# Altium schematic sheet POWER_MEASUREMENT.SchDoc
size 420 x 297 mm; SheetNumber: 6; SheetTotal: 32
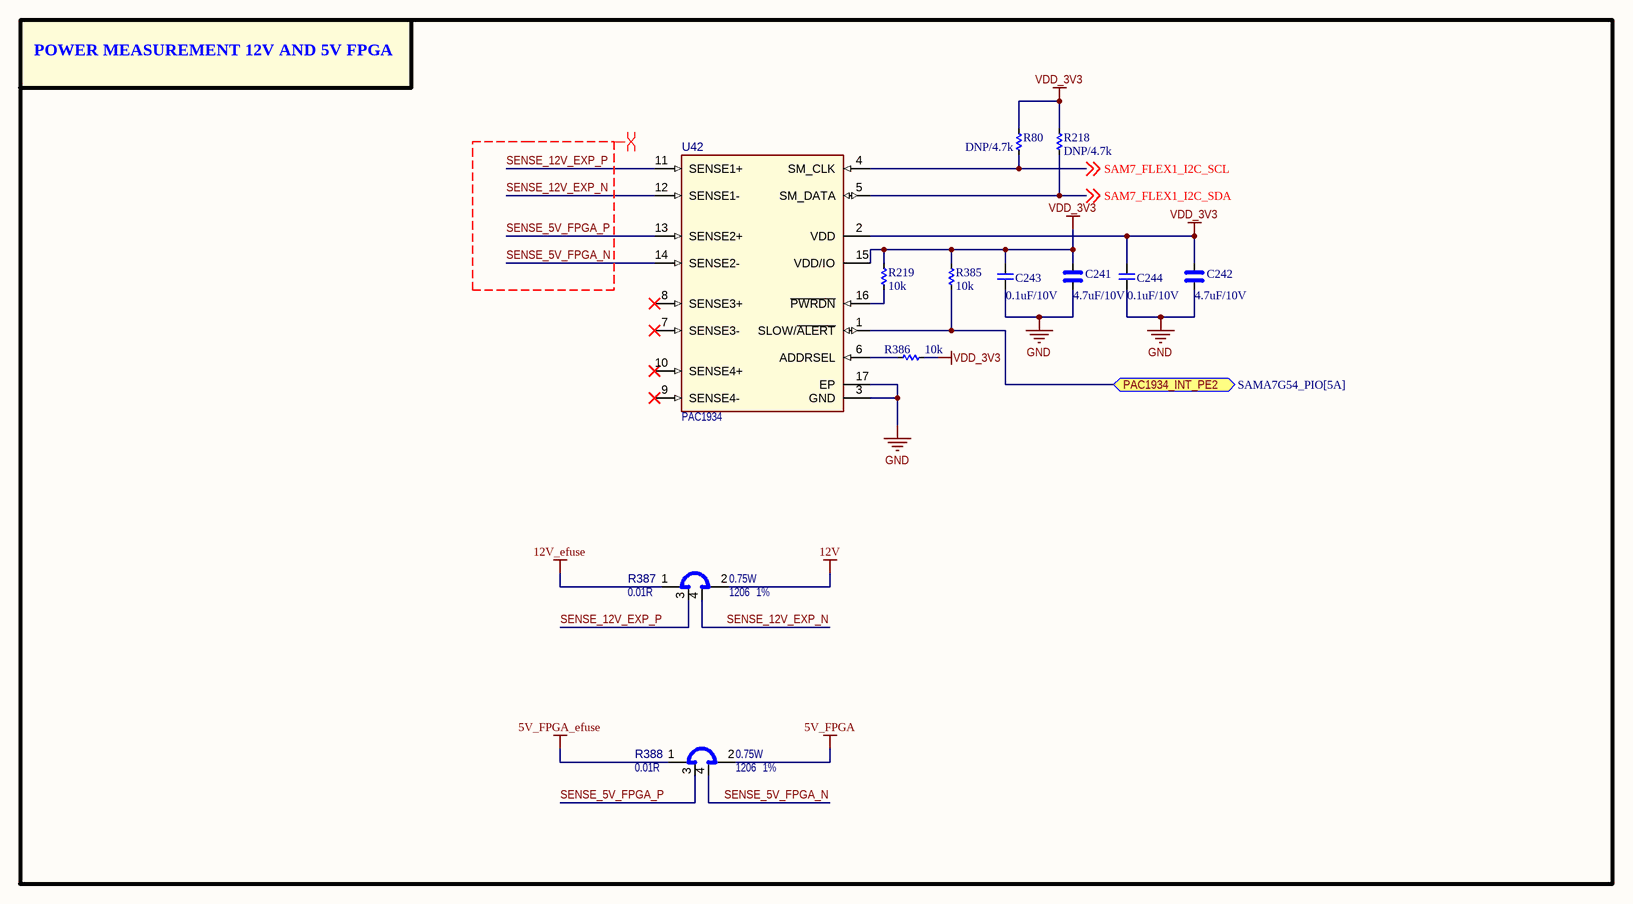
[diagram p0: POWER_MEASUREMENT.SchDoc]

## Parts
C241  4.7uF/10V  [CAP_C_1005X50_L]
C242  4.7uF/10V  [CAP_C_1005X50_L]
C243  0.1uF/10V  [CAP_C_1005X50_L]
C244  0.1uF/10V  [CAP_C_1005X50_L]
R80  DNP/4.7k  [RES_C_1005x30_L]
R218  DNP/4.7k  [RES_C_1005x30_L]
R219  10k  [RES_C_1005x30_L]
R385  10k  [RES_C_1005x30_L]
R386  10k  [RES_C_1005x30_L]
R387  value 0.01R  Package: 1206  Tolerance: 1%  Power: 0.75W  [RES_C_1206_SHUNT]  (hidden comment: KRL1632E-M-R010-F-T5)
R388  value 0.01R  Package: 1206  Tolerance: 1%  Power: 0.75W  [RES_C_1206_SHUNT]  (hidden comment: KRL1632E-M-R010-F-T5)
U42  value PAC1934  [UQFN-16_4X4_EP2.6X2.6]  (hidden comment: PAC1934 UQFN-16)

## Blocks framed on the sheet
POWER MEASUREMENT 12V AND 5V FPGA: C241-C244 R80 R218 R219 R385-R388 U42

## Ports
PAC1934_INT_PE2 (bidir, see SAMA7G54_PIO[5A])

## Nets
5V_FPGA: R388.2
5V_FPGA_efuse: R388.1
12V: R387.2
12V_efuse: R387.1
GND: C241.2 C242.2 C243.2 C244.2 U42.3(GND) U42.17(EP)
VDD_3V3: C241.1 C242.1 C243.1 C244.1 R80.1 R218.1 R219.1 R385.1 R386.2 U42.2(VDD) U42.15(VDD/IO)
PAC1934_INT_PE2: R385.2 U42.1(SLOW/~{ALERT}) ; port PAC1934_INT_PE2
SAM7_FLEX1_I2C_SCL: R80.2 U42.4(SM_CLK) ; off-sheet SAM7_FLEX1_I2C_SCL
SAM7_FLEX1_I2C_SDA: R218.2 U42.5(SM_DATA) ; off-sheet SAM7_FLEX1_I2C_SDA
SENSE_5V_FPGA_N: R388.4 U42.14(SENSE2-)
SENSE_5V_FPGA_P: R388.3 U42.13(SENSE2+)
SENSE_12V_EXP_N: R387.4 U42.12(SENSE1-)
SENSE_12V_EXP_P: R387.3 U42.11(SENSE1+)
NetR219_2: R219.2 U42.16(~{PWRDN})
NetR386_1: R386.1 U42.6(ADDRSEL)

Not connected (* = marked no-connect by the designer): U42 7(SENSE3-)* 8(SENSE3+)* 9(SENSE4-)* 10(SENSE4+)*

## Layout directives
differential pair: SENSE_5V_FPGA_N, SENSE_5V_FPGA_P, SENSE_12V_EXP_N, SENSE_12V_EXP_P

## Notes on the sheet
- Project:
- Sub-system:
- Design by:
- Sheet title:
- Sheet
- A3
- of
- Checked by:
- Approved by:
- Revision:
- Document No:
- Size:
- Date:

## Library data of the parts
C241 C242 = _CAP_C_High_2: CAP
C243 C244 = _CAP_C_2: CAP
R80 R218 R219 R385 R386 = _RES_B_2: RES
R387 R388 = RSMT1316: Shunt; Manufacturer 1: SUSUMU; Description_: RES SHUNT MF 0.01R 1% 0.75W SMD 1206; Dev Tools Status: Design; Temperature Coeffcient: 50ppm/C; Current: 8A; Owner: Ciprian Abramov; Populated: YES; MCHP-ID: RSMT1316; Revision: 1; Symbol: Shunt 4 Pin; Status: MCL Design; ComponentLink1URL: https://chn-vm-apps.microchip.com/mchprepo/parts/Datasheets/n_catalog_partition09_en.pdf; ComponentLink1Description: SVN Datasheet; ComponentLink2URL: C:\ALTIUM_WORK\00001_MCHP-CDB\Datasheets\n_catalog_partition09_en.pdf; ComponentLink2Description: Local Datasheet; ComponentLink3URL: C:\ALTIUM_WORK\00001_MCHP-CDB\Library\LibraryRefs\Shunt 4 Pin.SchLib; ComponentLink3Description: Open Symbol; ComponentLink4URL: C:\ALTIUM_WORK\00001_MCHP-CDB\Library\Footprints\RES_C_1206_SHUNT.PcbLib; ComponentLink4Description: Open Footprint; ComponentLink5Description: Open Footprint 2; ComponentLink6Description: Open Footprint 3; ComponentLink7Description: Open Footprint 4; Operating Temperature: -55C to +155C; Category: Resistor; Type: RES SMD; Composition: MF; Manufacturer Part Number 1: KRL1632E-M-R010-F-T5; Supplier 1: Digi-Key; Supplier Part Number 1: 408-1570-1-ND; Quantity Override: 1
U42 = MIC8883: Manufacturer 1: Microchip Technology; Manufacturer Part Number 1: PAC1934T-I/JQ; Description_: MCHP ANALOG POWER CURRENT SENSE MONITOR PAC1934T-I/JQ UQFN-16; Dev Tools Status: Design; Owner: Ciprian Abramov; Populated: YES; MCHP-ID: MIC8883; Symbol: PAC1934 UQFN-16; Type: Power/Current Sensor; Status: MCL Design; Revision: 1; Category: MCHP-Analog; ComponentLink1Description: SVN Datasheet; ComponentLink2Description: Local Datasheet; ComponentLink3URL: C:\ALTIUM_WORK\00001_MCHP-CDB\Library\LibraryRefs\PAC1934 UQFN-16.SchLib; ComponentLink3Description: Open Symbol; ComponentLink4URL: C:\ALTIUM_WORK\00001_MCHP-CDB\Library\Footprints\UQFN-16_4X4_EP2.6X2.6.PcbLib; ComponentLink4Description: Open Footprint; ComponentLink5Description: Open Footprint 2; ComponentLink6Description: Open Footprint 3; ComponentLink7Description: Open Footprint 4; Supplier 1: Digi-Key; Supplier Part Number 1: PAC1934T-I/JQCT-ND; Quantity Override: 1